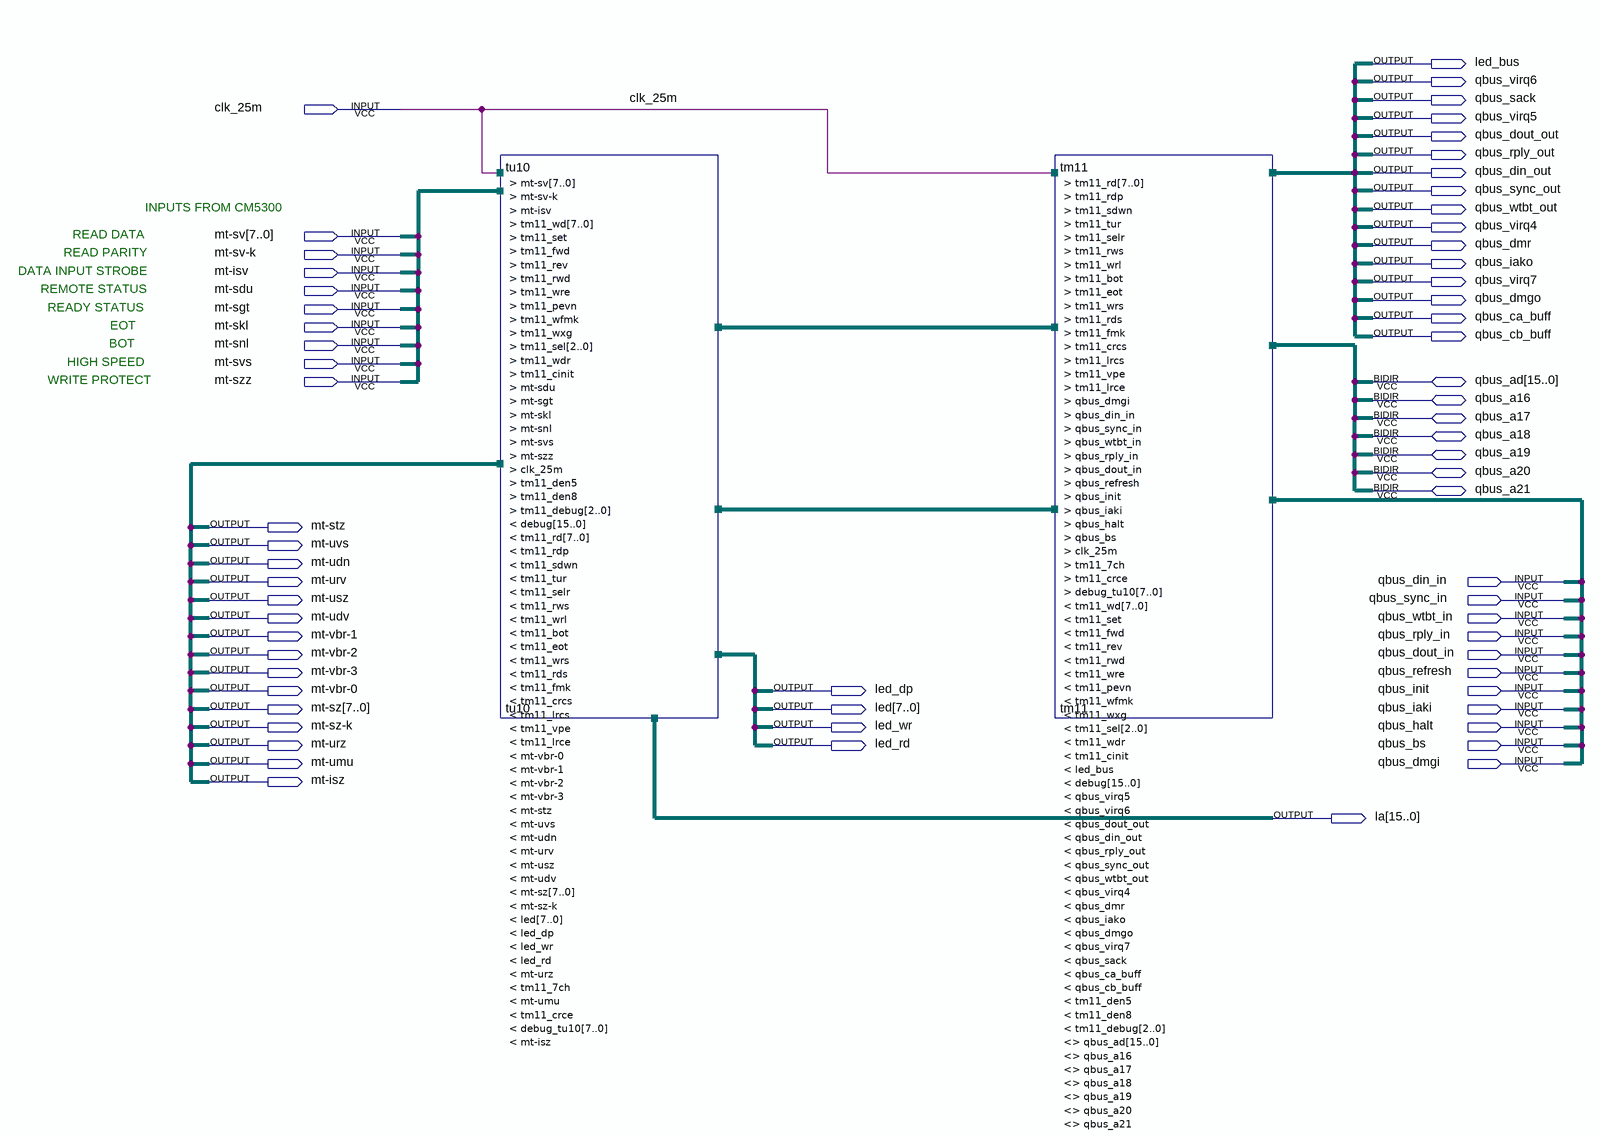
[diagram p0: schematic sheet]
// Quartus schematic mt11_controller_c-ii.bdf as structural Verilog: 2 symbols, 64 pins
module \mt11_controller_c-ii  (
  input  clk_25m,
  input  [7:0] \mt-sv ,
  input  \mt-sv-k ,
  input  \mt-isv ,
  input  \mt-sdu ,
  input  \mt-sgt ,
  input  \mt-skl ,
  input  \mt-snl ,
  input  \mt-svs ,
  input  \mt-szz ,
  input  qbus_din_in,
  input  qbus_sync_in,
  input  qbus_wtbt_in,
  input  qbus_rply_in,
  input  qbus_dout_in,
  input  qbus_refresh,
  input  qbus_init,
  input  qbus_iaki,
  input  qbus_halt,
  input  qbus_bs,
  input  qbus_dmgi,
  inout  [15:0] qbus_ad,
  inout  qbus_a16,
  inout  qbus_a17,
  inout  qbus_a18,
  inout  qbus_a19,
  inout  qbus_a20,
  inout  qbus_a21,
  output led_bus,
  output qbus_virq6,
  output qbus_sack,
  output qbus_virq5,
  output qbus_dout_out,
  output qbus_rply_out,
  output qbus_din_out,
  output qbus_sync_out,
  output qbus_wtbt_out,
  output qbus_virq4,
  output qbus_dmr,
  output qbus_iako,
  output qbus_virq7,
  output qbus_dmgo,
  output qbus_ca_buff,
  output qbus_cb_buff,
  output \mt-stz ,
  output \mt-uvs ,
  output \mt-udn ,
  output \mt-urv ,
  output \mt-usz ,
  output \mt-udv ,
  output \mt-vbr-1 ,
  output \mt-vbr-2 ,
  output \mt-vbr-3 ,
  output \mt-vbr-0 ,
  output led_dp,
  output [7:0] \mt-sz ,
  output [7:0] led,
  output \mt-sz-k ,
  output led_wr,
  output \mt-urz ,
  output led_rd,
  output \mt-umu ,
  output \mt-isz ,
  output [15:0] la
);

  wire tm11_7ch, tm11_bot, tm11_cinit, tm11_crce, tm11_crcs, tm11_den5, tm11_den8, tm11_eot, tm11_fmk,
       tm11_fwd, tm11_lrce, tm11_lrcs, tm11_pevn, tm11_rdp, tm11_rds, tm11_rev, tm11_rwd, tm11_rws,
       tm11_sdwn, tm11_selr, tm11_set, tm11_tur, tm11_vpe, tm11_wdr, tm11_wfmk, tm11_wre, tm11_wrl, tm11_wrs,
       tm11_wxg;
  wire [2:0] tm11_debug, tm11_sel;
  wire [7:0] debug_tu10, tm11_rd, tm11_wd;
  wire [15:0] debug;

  tu10 tu10 (
    .\mt-sv (\mt-sv ), .\mt-sv-k (\mt-sv-k ), .\mt-isv (\mt-isv ), .tm11_wd(tm11_wd), .tm11_set(tm11_set),
    .tm11_fwd(tm11_fwd), .tm11_rev(tm11_rev), .tm11_rwd(tm11_rwd), .tm11_wre(tm11_wre),
    .tm11_pevn(tm11_pevn), .tm11_wfmk(tm11_wfmk), .tm11_wxg(tm11_wxg), .tm11_sel(tm11_sel),
    .tm11_wdr(tm11_wdr), .tm11_cinit(tm11_cinit), .\mt-sdu (\mt-sdu ), .\mt-sgt (\mt-sgt ),
    .\mt-skl (\mt-skl ), .\mt-snl (\mt-snl ), .\mt-svs (\mt-svs ), .\mt-szz (\mt-szz ), .clk_25m(clk_25m),
    .tm11_den5(tm11_den5), .tm11_den8(tm11_den8), .tm11_debug(tm11_debug), .debug(la), .tm11_rd(tm11_rd),
    .tm11_rdp(tm11_rdp), .tm11_sdwn(tm11_sdwn), .tm11_tur(tm11_tur), .tm11_selr(tm11_selr),
    .tm11_rws(tm11_rws), .tm11_wrl(tm11_wrl), .tm11_bot(tm11_bot), .tm11_eot(tm11_eot), .tm11_wrs(tm11_wrs),
    .tm11_rds(tm11_rds), .tm11_fmk(tm11_fmk), .tm11_crcs(tm11_crcs), .tm11_lrcs(tm11_lrcs),
    .tm11_vpe(tm11_vpe), .tm11_lrce(tm11_lrce), .\mt-vbr-0 (\mt-vbr-0 ), .\mt-vbr-1 (\mt-vbr-1 ),
    .\mt-vbr-2 (\mt-vbr-2 ), .\mt-vbr-3 (\mt-vbr-3 ), .\mt-stz (\mt-stz ), .\mt-uvs (\mt-uvs ),
    .\mt-udn (\mt-udn ), .\mt-urv (\mt-urv ), .\mt-usz (\mt-usz ), .\mt-udv (\mt-udv ), .\mt-sz (\mt-sz ),
    .\mt-sz-k (\mt-sz-k ), .led(led), .led_dp(led_dp), .led_wr(led_wr), .led_rd(led_rd), .\mt-urz (\mt-urz ),
    .tm11_7ch(tm11_7ch), .\mt-umu (\mt-umu ), .tm11_crce(tm11_crce), .debug_tu10(debug_tu10),
    .\mt-isz (\mt-isz ));
  tm11 tm11 (
    .tm11_rd(tm11_rd), .tm11_rdp(tm11_rdp), .tm11_sdwn(tm11_sdwn), .tm11_tur(tm11_tur),
    .tm11_selr(tm11_selr), .tm11_rws(tm11_rws), .tm11_wrl(tm11_wrl), .tm11_bot(tm11_bot),
    .tm11_eot(tm11_eot), .tm11_wrs(tm11_wrs), .tm11_rds(tm11_rds), .tm11_fmk(tm11_fmk),
    .tm11_crcs(tm11_crcs), .tm11_lrcs(tm11_lrcs), .tm11_vpe(tm11_vpe), .tm11_lrce(tm11_lrce),
    .qbus_dmgi(qbus_dmgi), .qbus_din_in(qbus_din_in), .qbus_sync_in(qbus_sync_in),
    .qbus_wtbt_in(qbus_wtbt_in), .qbus_rply_in(qbus_rply_in), .qbus_dout_in(qbus_dout_in),
    .qbus_refresh(qbus_refresh), .qbus_init(qbus_init), .qbus_iaki(qbus_iaki), .qbus_halt(qbus_halt),
    .qbus_bs(qbus_bs), .clk_25m(clk_25m), .tm11_7ch(tm11_7ch), .tm11_crce(tm11_crce),
    .debug_tu10(debug_tu10), .tm11_wd(tm11_wd), .tm11_set(tm11_set), .tm11_fwd(tm11_fwd),
    .tm11_rev(tm11_rev), .tm11_rwd(tm11_rwd), .tm11_wre(tm11_wre), .tm11_pevn(tm11_pevn),
    .tm11_wfmk(tm11_wfmk), .tm11_wxg(tm11_wxg), .tm11_sel(tm11_sel), .tm11_wdr(tm11_wdr),
    .tm11_cinit(tm11_cinit), .led_bus(led_bus), .debug(debug), .qbus_virq5(qbus_virq5),
    .qbus_virq6(qbus_virq6), .qbus_dout_out(qbus_dout_out), .qbus_din_out(qbus_din_out),
    .qbus_rply_out(qbus_rply_out), .qbus_sync_out(qbus_sync_out), .qbus_wtbt_out(qbus_wtbt_out),
    .qbus_virq4(qbus_virq4), .qbus_dmr(qbus_dmr), .qbus_iako(qbus_iako), .qbus_dmgo(qbus_dmgo),
    .qbus_virq7(qbus_virq7), .qbus_sack(qbus_sack), .qbus_ca_buff(qbus_ca_buff), .qbus_cb_buff(qbus_cb_buff),
    .tm11_den5(tm11_den5), .tm11_den8(tm11_den8), .tm11_debug(tm11_debug), .qbus_ad(qbus_ad),
    .qbus_a16(qbus_a16), .qbus_a17(qbus_a17), .qbus_a18(qbus_a18), .qbus_a19(qbus_a19), .qbus_a20(qbus_a20),
    .qbus_a21(qbus_a21));

  // Notes on the sheet:
  //   INPUTS FROM CM5300
  //   READ DATA
  //   READ PARITY
  //   DATA INPUT STROBE
  //   REMOTE STATUS
  //   READY STATUS
  //   EOT
  //   BOT
  //   HIGH SPEED
  //   WRITE PROTECT
endmodule
